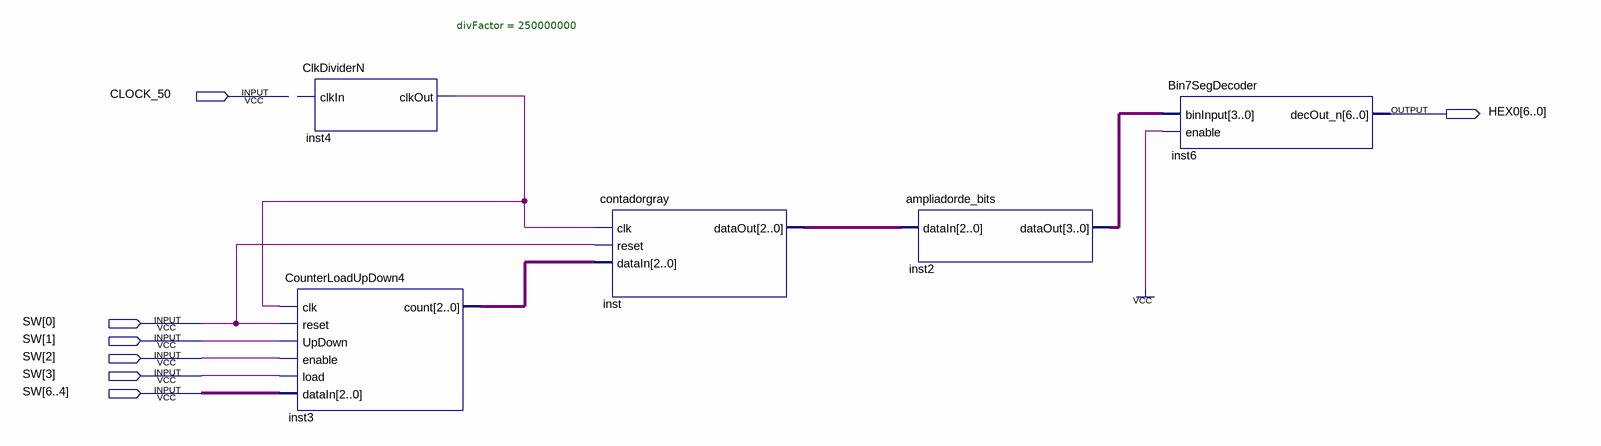
[diagram p0: schematic sheet]
// Quartus schematic contadorgrayDemo.bdf as structural Verilog: 5 symbols, 7 pins
module contadorgrayDemo (
  input  CLOCK_50,
  input  [6:0] SW,
  output [6:0] HEX0
);

  wire inst4_clkout;
  wire [2:0] inst3_count, inst_dataout;
  wire [3:0] inst2_dataout;

  ClkDividerN #(.divFactor(250000000)) inst4 (.clkOut(inst4_clkout));  // open: clkIn
  CounterLoadUpDown4 inst3 (
    .clk(inst4_clkout), .reset(SW[0]), .UpDown(SW[1]), .enable(SW[2]), .load(SW[3]), .dataIn(SW[6:4]),
    .count(inst3_count));
  contadorgray inst (.clk(inst4_clkout), .reset(SW[0]), .dataIn(inst3_count), .dataOut(inst_dataout));
  ampliadorde_bits inst2 (.dataIn(inst_dataout), .dataOut(inst2_dataout));
  Bin7SegDecoder inst6 (.binInput(inst2_dataout), .enable(1'b1), .decOut_n(HEX0));
endmodule
